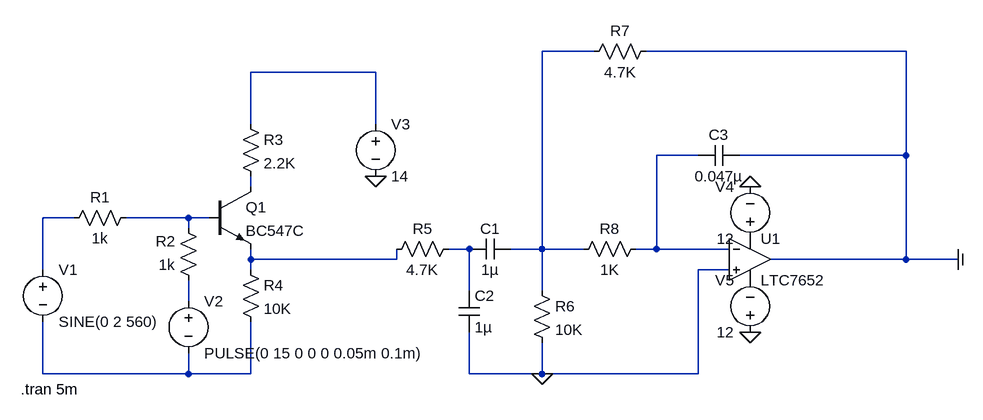
[diagram p0: schematic ppm.asc]
ppm.asc, the LTspice schematic file:
Version 4
SHEET 1 1504 680
WIRE 832 -176 752 -176
WIRE 1312 -176 912 -176
WIRE 496 -144 304 -144
WIRE 304 -64 304 -144
WIRE 496 -64 496 -144
WIRE 992 -16 928 -16
WIRE 1312 -16 1312 -176
WIRE 1312 -16 1056 -16
WIRE 304 32 304 16
WIRE 32 80 -16 80
WIRE 208 80 112 80
WIRE 240 80 208 80
WIRE 208 96 208 80
WIRE 640 128 608 128
WIRE 752 128 752 -176
WIRE 752 128 704 128
WIRE 816 128 752 128
WIRE 928 128 928 -16
WIRE 928 128 896 128
WIRE 1040 128 928 128
WIRE 304 144 304 128
WIRE 528 144 528 128
WIRE 528 144 304 144
WIRE 1312 144 1312 -16
WIRE 1312 144 1104 144
WIRE 1392 144 1312 144
WIRE -16 160 -16 80
WIRE 304 160 304 144
WIRE 1040 160 992 160
WIRE 640 192 640 128
WIRE 752 192 752 128
WIRE 208 208 208 176
WIRE -16 320 -16 240
WIRE 208 320 208 288
WIRE 208 320 -16 320
WIRE 304 320 304 240
WIRE 304 320 208 320
WIRE 640 320 640 256
WIRE 752 320 752 272
WIRE 752 320 640 320
WIRE 992 320 992 160
WIRE 992 320 752 320
FLAG 496 16 0
FLAG 752 320 0
FLAG 1072 32 0
FLAG 1072 256 0
FLAG 1392 144 COM
IOPIN 1392 144 Out
SYMBOL voltage -16 144 R0
WINDOW 123 0 0 Left 0
WINDOW 39 0 0 Left 0
SYMATTR InstName V1
SYMATTR Value SINE(0 2 560)
SYMBOL voltage 208 192 R0
WINDOW 123 0 0 Left 0
WINDOW 39 0 0 Left 0
SYMATTR InstName V2
SYMATTR Value PULSE(0 15 0 0 0 0.05m 0.1m)
SYMBOL voltage 496 -80 R0
WINDOW 123 0 0 Left 0
WINDOW 39 0 0 Left 0
SYMATTR InstName V3
SYMATTR Value 14
SYMBOL res 128 64 R90
WINDOW 0 0 56 VBottom 2
WINDOW 3 32 56 VTop 2
SYMATTR InstName R1
SYMATTR Value 1k
SYMBOL res 224 192 R180
WINDOW 0 36 76 Left 2
WINDOW 3 36 40 Left 2
SYMATTR InstName R2
SYMATTR Value 1k
SYMBOL res 288 -80 R0
SYMATTR InstName R3
SYMATTR Value 2.2K
SYMBOL npn 240 32 R0
SYMATTR InstName Q1
SYMATTR Value BC547C
SYMBOL res 288 144 R0
SYMATTR InstName R4
SYMATTR Value 10K
SYMBOL res 624 112 R90
WINDOW 0 0 56 VBottom 2
WINDOW 3 32 56 VTop 2
SYMATTR InstName R5
SYMATTR Value 4.7K
SYMBOL cap 704 112 R90
WINDOW 0 0 32 VBottom 2
WINDOW 3 32 32 VTop 2
SYMATTR InstName C1
SYMATTR Value 1µ
SYMBOL cap 624 192 R0
SYMATTR InstName C2
SYMATTR Value 1µ
SYMBOL res 928 -192 R90
WINDOW 0 0 56 VBottom 2
WINDOW 3 32 56 VTop 2
SYMATTR InstName R7
SYMATTR Value 4.7K
SYMBOL res 912 112 R90
WINDOW 0 0 56 VBottom 2
WINDOW 3 32 56 VTop 2
SYMATTR InstName R8
SYMATTR Value 1K
SYMBOL cap 1056 -32 R90
WINDOW 0 0 32 VBottom 2
WINDOW 3 32 32 VTop 2
SYMATTR InstName C3
SYMATTR Value 0.047µ
SYMBOL res 736 176 R0
SYMATTR InstName R6
SYMATTR Value 10K
SYMBOL voltage 1072 128 R180
WINDOW 0 24 96 Left 2
WINDOW 3 24 16 Left 2
WINDOW 123 0 0 Left 0
WINDOW 39 0 0 Left 0
SYMATTR InstName V4
SYMATTR Value 12
SYMBOL voltage 1072 272 R180
WINDOW 0 24 96 Left 2
WINDOW 3 24 16 Left 2
WINDOW 123 0 0 Left 0
WINDOW 39 0 0 Left 0
SYMATTR InstName V5
SYMATTR Value 12
SYMBOL OpAmps\\LTC7652 1072 80 R0
SYMATTR InstName U1
TEXT -50 344 Left 2 !.tran 5m

The netlist it stands for:
* ppm.asc
V1 N005 N010 SINE(0 2 560)
V2 N009 N010 PULSE(0 15 0 0 0 0.05m 0.1m)
V3 N002 0 14
R1 N006 N005 1k
R2 N009 N006 1k
R3 N002 N004 2.2K
Q1 N004 N006 N008 0 BC547C
R4 N008 N010 10K
R5 N007 N008 4.7K
C1 N001 N007 1µ
C2 N007 0 1µ
R7 COM N001 4.7K
R8 N003 N001 1K
C3 COM N003 0.047µ
R6 N001 0 10K
V4 P001 0 12
V5 0 P002 12
XU1 0 N003 P001 P002 COM LTC1052  ; LTC7652, pins In+ In- V+ V- OUT
.model NPN NPN
.model PNP PNP
.lib standard.bjt
.tran 5m
.backanno
.end